# EAGLE design LabDuinoBt (EAGLE 7.2.0)
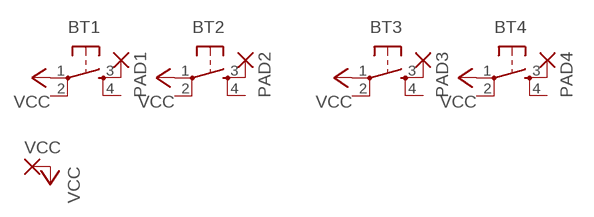
[diagram p0: schematic, sheet 1]

## Parts
BT1  TAC_SWITCHPTH  [TACTILE-PTH]
BT2  TAC_SWITCHPTH  [TACTILE-PTH]
BT3  TAC_SWITCHPTH  [TACTILE-PTH]
BT4  TAC_SWITCHPTH  [TACTILE-PTH]
PAD1  1,6/0,9  [1,6/0,9]
PAD2  1,6/0,9  [1,6/0,9]
PAD3  1,6/0,9  [1,6/0,9]
PAD4  1,6/0,9  [1,6/0,9]
VCC  1,6/0,9  [1,6/0,9]

## Nets
N$1: BT1.3 PAD1.1(P)
N$2: BT2.3 PAD2.1(P)
N$3: BT3.3 PAD3.1(P)
N$4: BT4.3 PAD4.1(P)
VCC: BT1.1 BT2.1 BT3.1 BT4.1 VCC.1(P)
Unconnected: BT1.2 BT1.4 BT2.2 BT2.4 BT3.2 BT3.4 BT4.2 BT4.4

## Library data of the parts
BT1-BT4 = SparkFun-Retired:TAC_SWITCH: Momentary Switch Button commonly used for reset or general input. Spark Fun Electronics SKU : COM-00097 SMT- SWCH-08247
PAD1-PAD4 VCC = wirepad:1,6/0,9: THROUGH-HOLE PAD

## Net classes
0 default: width 0.381 mm, drill 0.508 mm, clearance 2 mm

## Board
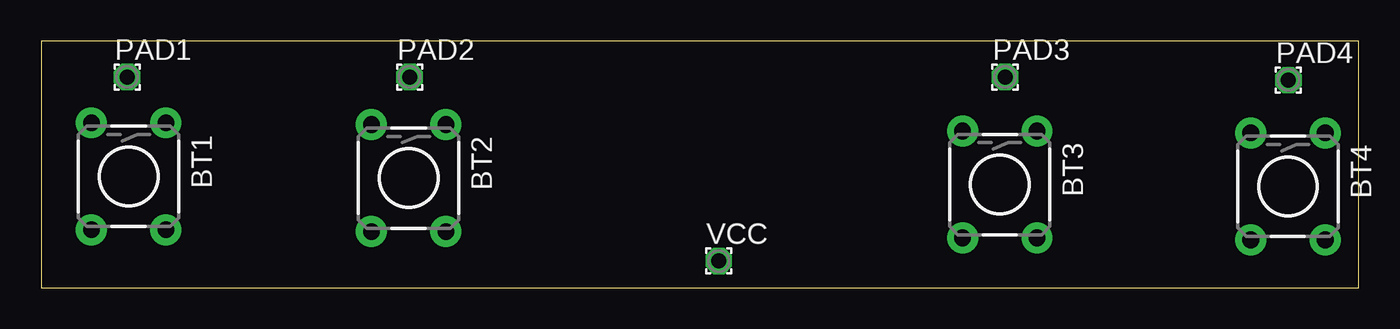
[diagram p1: board, top side]
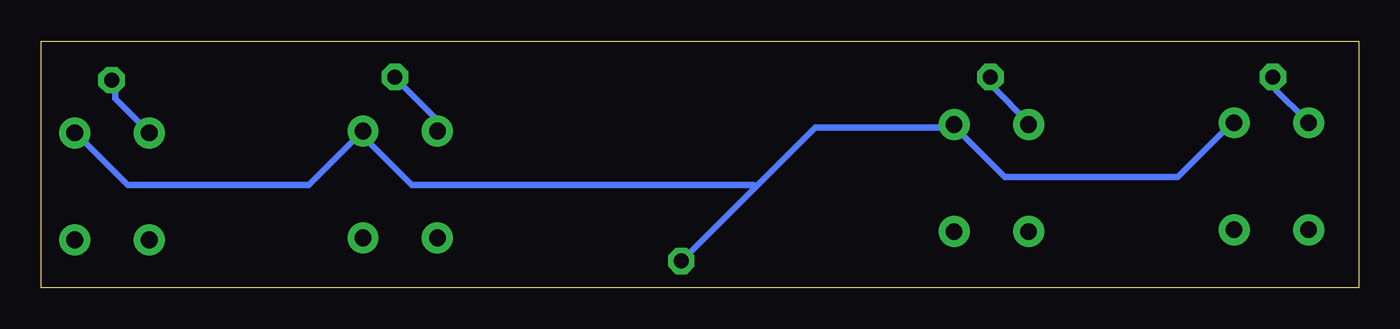
[diagram p2: board, bottom side, seen from below]

Size 80 x 15 mm. Coordinates in mm from the lower left corner, seen from the top.
Outline: 0,0 80,0 80,15 0,15 0,0
Copper layers (1*16): Top 0.035mm / dielectric 1.5mm / Bottom 0.035mm
Design rules "default": minimum track width 10mil, minimum drill 24mil, track to track 8mil, track to pad 8mil, pad to pad 8mil, via to via 8mil, smd to smd 8mil, copper to edge 40mil, drill to drill 8mil, minimum pad ring 10mil, minimum via ring 8mil, stop-mask expansion 4mil, vias tented up to drill 0mil, thermal gap 10mil

### Footprints (pad centres in the part's own frame; a part is rotated, then mirrored left to right if it is on the bottom)
TACTILE-PTH = drill 1.016 pad 1.88: 1 -3.251,2.261; 2 3.251,2.261; 3 -3.251,-2.261; 4 3.251,-2.261
1,6/0,9 = drill 0.914 pad 1.6 octagon: 1 0,0

### Placement (x,y rotation side)
BT1  5.31,6.78 270 top
BT2  22.31,6.67 270 top
BT3  58.2,6.28 270 top
BT4  75.7,6.17 270 top
PAD1  5.22,12.82 0 top
PAD2  22.37,12.82 0 top
PAD3  58.52,12.82 0 top
PAD4  75.72,12.63 0 top
VCC  41.14,1.63 0 top

### Tracks (layer width: path | path; a pad name or v marks a point on that pad's centre or on a via)
N$1
  Bottom 0.381: PAD1.1 5,12.75 5,12 3.25,10.25 BT1.3
N$2
  Bottom 0.381: PAD2.1 22.25,12.75 22.25,12.25 20,10 BT2.3
N$3
  Bottom 0.381: PAD3.1 58.5,12.75 56,10.25 56,9.75 BT3.3
N$4
  Bottom 0.381: PAD4.1 75.5,12.5 75.5,11.5 73.5,9.5 BT4.3
VCC
  Bottom 0.381: BT4.1 77.75,9.25 74.75,6.25 63.75,6.25 60.5,9.5 BT3.1 60.5,9.25 57.5,6.25 36.75,6.25 36.62,6.12 | 36.62,6.12 33,9.75 24.75,9.75 BT2.1 24.5,9.75 21.5,6.75 11,6.75 7.75,10 BT1.1 | 36.62,6.12 41,1.75 VCC.1